# Altium project 2224_BuzzerWireGame.PrjPcb
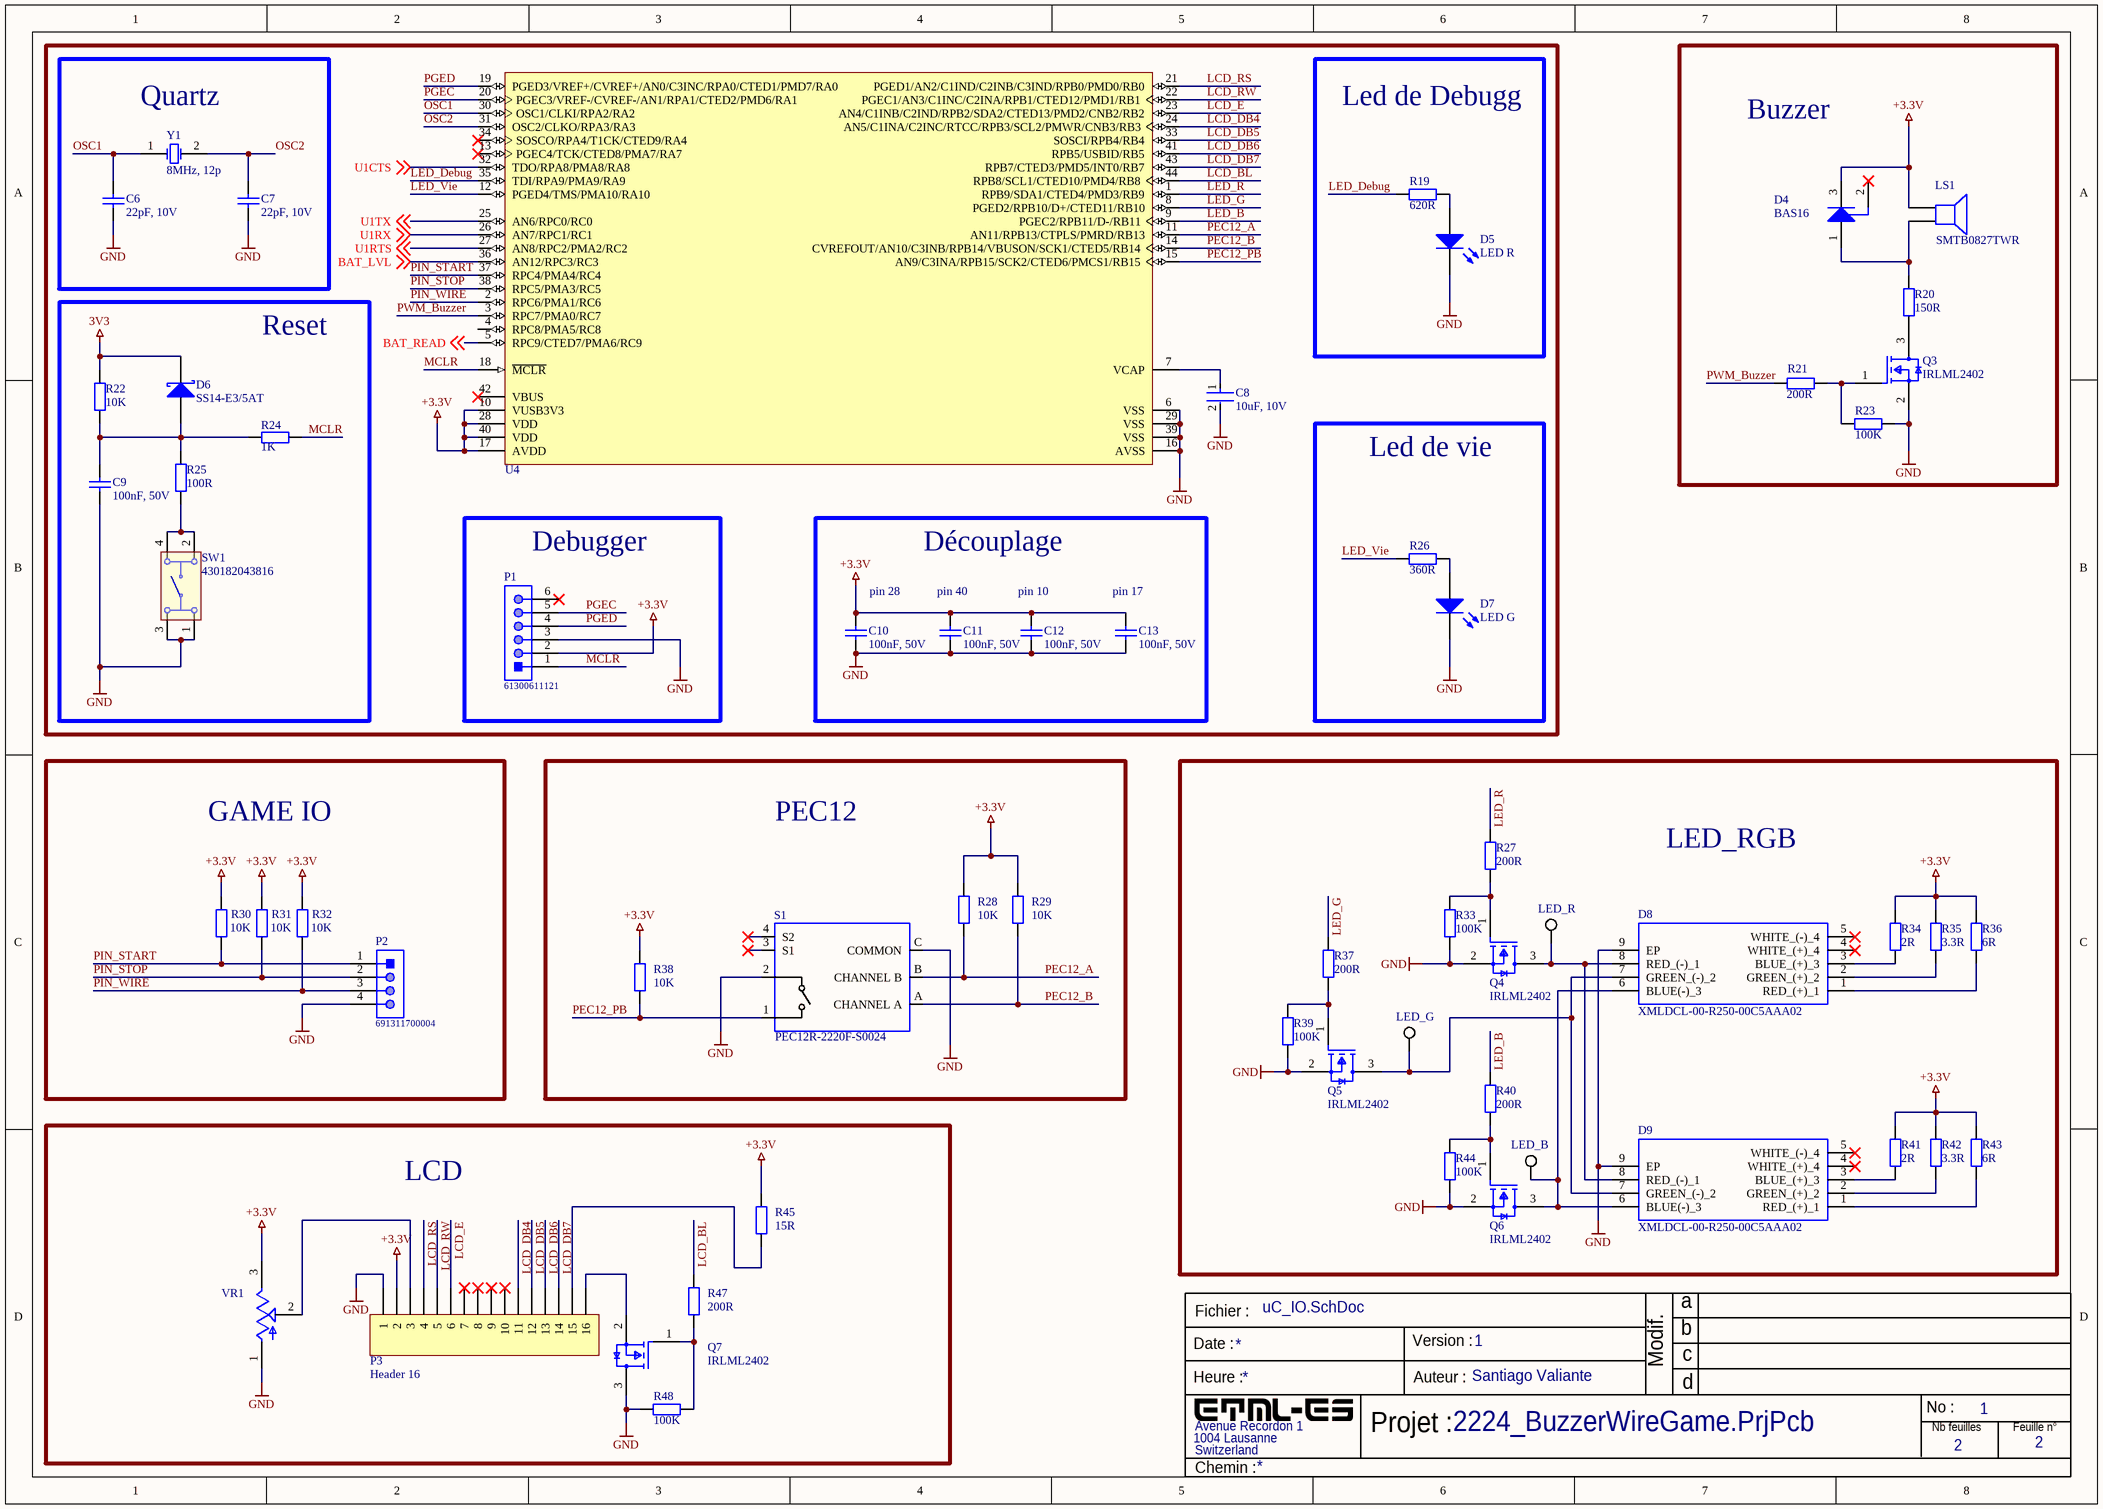
[diagram p0: uC_IO.SchDoc]
1 sheet, 60 parts. Net scope: global (net labels, ports and power ports of the same name join across sheets).
Board file: 2224_BuzzerWireGame.PcbDoc

## Sheet uC_IO.SchDoc
size A3; Author: Santiago Valiante; Organization: ETML-ES; Address1: Avenue Recordon 1; Address2: 1004 Lausanne; Address3: Switzerland; Revision: 1; SheetNumber: 2; SheetTotal: 2; SPICEModelCacheLIPLDXEE: <root> / <DocumentId>LIPLDXEE</DocumentId> / <CacheFrame Number="0"> / <Model Name="led2" Kind="MDL"> / <Text>*Typ RED,GREEN,YELLOW,AMBER GaAs LED: Vf=2.1V Vr=4V If=40mA trr=3uS / *LED Pinout: 1=A, 2=K / .MODEL LED2 D (IS=93.1P RS=42M N=4.61 BV=4 IBV=10U / + CJO=2.97P VJ=.75 M=.333 TT=4.32U)</Text> / </Model> / </CacheFrame> / </root>; Version: 1

### Parts
C6  22pF, 10V  [CAP_0805]
C7  22pF, 10V  [CAP_0805]
C8  10uF, 10V  [CAP_0805]
C9  100nF, 50V  [CAP_0805]
C10  100nF, 50V  [CAP_0805]
C11  100nF, 50V  [CAP_0805]
C12  100nF, 50V  [CAP_0805]
C13  100nF, 50V  [CAP_0805]
D4  BAS16  [INF-SOT23_L]
D5  LED R  [3.2X1.6X1.1]
D6  SS14-E3/5AT  [VISH-DO-214AC-2_V]
D7  LED G  [3.2X1.6X1.1]
D8  XMLDCL-00-R250-00C5AAA02  [XMLDCL00R25000C5AAA02]
D9  XMLDCL-00-R250-00C5AAA02  [XMLDCL00R25000C5AAA02]
LED_B  Vbat  [KSTN-5019_V]  (value not drawn)
LED_G  Vbat  [KSTN-5019_V]  (value not drawn)
LED_R  Vbat  [KSTN-5019_V]  (value not drawn)
LS1  SMTB0827TWR  [XDCR_SMTB-0827-TW-R]
P1  61300611121  [61300611121]
P2  691311700004  [691311700004]
P3  Header 16  [SHDR16W77P254_2X8_2764X859X1004P]
Q3  IRLML2402  [FP-Micro3-IPC_B]
Q4  IRLML2402  [FP-Micro3-IPC_B]
Q5  IRLML2402  [FP-Micro3-IPC_B]
Q6  IRLML2402  [FP-Micro3-IPC_B]
Q7  IRLML2402  [FP-Micro3-IPC_B]
R19  620R  [RES_0805]
R20  150R  [RES_0805]
R21  200R  [RES_0805]
R22  10K  [RES_0805]
R23  100K  [RES_0805]
R24  1K  [RES_0805]
R25  100R  [RES_0805]
R26  360R  [RES_0805]
R27  200R  [RES_0805]
R28  10K  [RES_0805]
R29  10K  [RES_0805]
R30  10K  [RES_0805]
R31  10K  [RES_0805]
R32  10K  [RES_0805]
R33  100K  [RES_0805]
R34  2R  [RES_0805]
R35  3.3R  [RES_0805]
R36  6R  [RES_0805]
R37  200R  [RES_0805]
R38  10K  [RES_0805]
R39  100K  [RES_0805]
R40  200R  [RES_0805]
R41  2R  [RES_0805]
R42  3.3R  [RES_0805]
R43  6R  [RES_0805]
R44  100K  [RES_0805]
R45  15R  [RES_0805]
R47  200R  [RES_0805]
R48  100K  [RES_0805]
S1  PEC12R-2220F-S0024  [XDCR_PEC12R-2220F-S0024]
SW1  430182043816  [430182043816]
U4  PIC32MX250F256D-I/PT  [MCHP-TQFP-PT44_M]  (value not drawn)
VR1  3362P-1-102LF  [TRIM_3362P-1-102LF]  (value not drawn)
Y1  8MHz, 12p  [FOX-FOXSDLF160-20_V]

### Blocks framed on the sheet
Quartz: C6 C7 Y1
Led de Debugg: D5 R19
Buzzer: D4 LS1 Q3 R20 R21 R23
Reset: C9 D6 R22 R24 R25 SW1
Led de vie: D7 R26
Debugger: P1
Découplage: C10-C13
GAME IO: P2 R30-R32
PEC12: R28 R29 R38 S1
LED_RGB: D8 D9 LED_B LED_G LED_R Q4-Q6 R27 R33-R37 R39-R44
LCD: P3 Q7 R45 R47 R48 VR1

### Nets
3V3: D6.2(K) R22.2
+3.3V: C10.1 C11.1 C12.1 C13.1 D4.3(K) LS1.P P1.2 P3.2 R28.2 R29.2 R30.2 R31.2 R32.2 R34.1 R35.1 R36.1 R38.2 R41.1 R42.1 R43.1 R45.2 U4.10(VUSB3V3) U4.17(AVDD) U4.28(VDD) U4.40(VDD) VR1.3(CW)
GND: C6.1 C7.1 C8.2 C9.2 C10.2 C11.2 C12.2 C13.2 D5.2(K) D7.2(K) D8.9(EP) D9.9(EP) P1.3 P2.4 P3.1 Q3.2(S) Q4.2(S) Q5.2(S) Q6.2(S) Q7.3(D) R23.2 R33.2 R39.2 R44.2 R48.2 S1.2 S1.C(COMMON) SW1.1 SW1.3 U4.6(VSS) U4.16(AVSS) U4.29(VSS) U4.39(VSS) VR1.1(CCW)
BAT_LVL: U4.36(AN12/RPC3/RC3) ; off-sheet BAT_LVL
BAT_READ: U4.5(RPC9/CTED7/PMA6/RC9) ; off-sheet BAT_READ
LCD_BL: R47.2 U4.44(RPB8/SCL1/CTED10/PMD4/RB8)
LCD_DB4: P3.11 U4.24(AN5/C1INA/C2INC/RTCC/RPB3/SCL2/PMWR/CNB3/RB3)
LCD_DB5: P3.12 U4.33(SOSCI/RPB4/RB4)
LCD_DB6: P3.13 U4.41(RPB5/USBID/RB5)
LCD_DB7: P3.14 U4.43(RPB7/CTED3/PMD5/INT0/RB7)
LCD_E: P3.6 U4.23(AN4/C1INB/C2IND/RPB2/SDA2/CTED13/PMD2/CNB2/RB2)
LCD_RS: P3.4 U4.21(PGED1/AN2/C1IND/C2INB/C3IND/RPB0/PMD0/RB0)
LCD_RW: P3.5 U4.22(PGEC1/AN3/C1INC/C2INA/RPB1/CTED12/PMD1/RB1)
LED_B: R40.2 U4.9(PGEC2/RPB11/D-/RB11)
LED_Debug: R19.2 U4.35(TDI/RPA9/PMA9/RA9)
LED_G: R37.2 U4.8(PGED2/RPB10/D+/CTED11/RB10)
LED_R: R27.2 U4.1(RPB9/SDA1/CTED4/PMD3/RB9)
LED_Vie: R26.2 U4.12(PGED4/TMS/PMA10/RA10)
MCLR: P1.1 R24.2 U4.18(~{MCLR})
OSC1: C6.2 U4.30(OSC1/CLKI/RPA2/RA2) Y1.1(X1)
OSC2: C7.2 U4.31(OSC2/CLKO/RPA3/RA3) Y1.2(X2)
PEC12_A: R28.1 S1.B(CHANNEL_B) U4.11(AN11/RPB13/CTPLS/PMRD/RB13)
PEC12_B: R29.1 S1.A(CHANNEL_A) U4.14(CVREFOUT/AN10/C3INB/RPB14/VBUSON/SCK1/CTED5/RB14)
PEC12_PB: R38.1 S1.1 U4.15(AN9/C3INA/RPB15/SCK2/CTED6/PMCS1/RB15)
PGEC: P1.5 U4.20(PGEC3/VREF-/CVREF-/AN1/RPA1/CTED2/PMD6/RA1)
PGED: P1.4 U4.19(PGED3/VREF+/CVREF+/AN0/C3INC/RPA0/CTED1/PMD7/RA0)
PIN_START: P2.1 R30.1 U4.37(RPC4/PMA4/RC4)
PIN_STOP: P2.2 R31.1 U4.38(RPC5/PMA3/RC5)
PIN_WIRE: P2.3 R32.1 U4.2(RPC6/PMA1/RC6)
PWM_Buzzer: R21.1 U4.3(RPC7/PMA0/RC7)
U1CTS: U4.32(TDO/RPA8/PMA8/RA8) ; off-sheet U1CTS
U1RTS: U4.27(AN8/RPC2/PMA2/RC2) ; off-sheet U1RTS
U1RX: U4.26(AN7/RPC1/RC1) ; off-sheet U1RX
U1TX: U4.25(AN6/RPC0/RC0) ; off-sheet U1TX
NetC8_1: C8.1 U4.7(VCAP)
NetC9_1: C9.1 D6.1(A) R22.1 R24.1 R25.2
NetD4_1: D4.1(A) LS1.N R20.1
NetD5_1: D5.1(A) R19.1
NetD7_1: D7.1(A) R26.1
NetD8_1: D8.1(RED_(+)_1) R36.2
NetD8_2: D8.2(GREEN_(+)_2) R35.2
NetD8_3: D8.3(BLUE_(+)_3) R34.2
NetD8_6: D8.6(BLUE(-)_3) D9.6(BLUE(-)_3) LED_B.1 Q6.3(D)
NetD8_7: D8.7(GREEN_(-)_2) D9.7(GREEN_(-)_2) LED_G.1 Q5.3(D)
NetD8_8: D8.8(RED_(-)_1) D9.8(RED_(-)_1) LED_R.1 Q4.3(D)
NetD9_1: D9.1(RED_(+)_1) R43.2
NetD9_2: D9.2(GREEN_(+)_2) R42.2
NetD9_3: D9.3(BLUE_(+)_3) R41.2
NetP3_3: P3.3 VR1.2(WIPER)
NetP3_15: P3.15 R45.1
NetP3_16: P3.16 Q7.2(S)
NetQ3_1: Q3.1(G) R21.2 R23.1
NetQ3_3: Q3.3(D) R20.2
NetQ4_1: Q4.1(G) R27.1 R33.1
NetQ5_1: Q5.1(G) R37.1 R39.1
NetQ6_1: Q6.1(G) R40.1 R44.1
NetQ7_1: Q7.1(G) R47.1 R48.1
NetR25_1: R25.1 SW1.2 SW1.4

Not connected (* = marked no-connect by the designer): D4 2(NC)*; D8 4(WHITE_(+)_4)* 5(WHITE_(-)_4)*; D9 4(WHITE_(+)_4)* 5(WHITE_(-)_4)*; P1 6*; P3 7* 8* 9* 10*; S1 3(S1)* 4(S2)*; U4 4(RPC8/PMA5/RC8) 13(PGEC4/TCK/CTED8/PMA7/RA7)* 34(SOSCO/RPA4/T1CK/CTED9/RA4)* 42(VBUS)*

### Notes on the sheet
- (near C10) pin 28
- (near C11) pin 40
- (near C12) pin 10
- (near C13) pin 17
- Fichier :
- a
- Date :
- Heure :
- Version :
- Auteur :
- Modif.
- b
- c
- d
- Projet :
- No :
- Nb feuilles
- Feuille n°
- Chemin :

### Library data of the parts
C6 C7 = CMP-1036-01211-1: CAP 22pF 10V ±10% 0805 (2012 Metric) Thickness 0.75mm SMD; Case-Metric: 2012; Tolerance: Â±10%; Case-EIA: 0805; Rated Voltage: 10 V; Technology: SMT; Max Thickness: 0.75 mm; Value: 22pF
C8 = CMP-2007-03243-2: CAP CER 10UF 10V X5R 0805; Manufacturer Part Number: C0805C106K8PACTU; Manufacturer: Kemet; 3DS Part Number: 220-00001; Tolerance: 10%; Temperature Coefficient: 15%; Material: Ceramic; Device Class L2: Capacitors; Device Class L1: Passive Components; ComponentLink2URL: https://content.kemet.com/datasheets/KEM_C1006_X5R_SMD.pdf; Height: 1.4mm; Lead Free: Yes; Digikey Description: CAP CER 10UF 10V X5R 0805; Octopart: https://octopart.com/c0805c106k8pactu-kemet-98697; Capacitance: 10uF; Value: 10uF; Temperature Range Low: -55°C; Temperature: -55°C to +85°C; Automotive: No; Mouser Description: CAP CER 10UF 10V X5R 0805; Ipc Land Pattern Name: CAPC200125X125; Temperature Range High: +85°C; Voltage: 10V; RoHS: TRUE; Device Class L3: Ceramic Capacitors; ComponentLink2Description: Datasheet; Voltage Rating: 10V; Package: C0805C-DG; Temperature Characteristic: X5R; Category: Cap
C9-C13 = 885012207098: WCAP-CSGP General Purpose Ceramic Capacitors, size 0805, 100nF, +/-10%, 50VDC; Isolation Resistance: >=5GOhm; Ceramic Type: X7R; Technical Reference: X7R0805104K050DFCT10000; ComponentLink1Description: Manufacturer; ComponentLink1URL: http://www.we-online.de; ComponentLink2Description: Datasheet; ComponentLink2URL: https://katalog.we-online.com/pbs/datasheet/885012207098.pdf; Operating Temperature: -55 to +125degC; Packaging: Tape and Reel; Part Number: 885012207098; Publisher: Wurth Elektronik; Rated Voltage: 50VDC; Published Date: August 2019; Capacitance Tolerance: +/-10%; Dissipation Factor: =<2.5%; Height: 0.8mm +/-0.10mm; Mounting Technology: SMD; Size: 0805; Capacitance: 100nF; Supplier 1: Digi-Key; Supplier Part Number 1: 732-8080-1-ND; Supplier 2: Distrelec; Supplier Part Number 2: 30067953
D4 = CMP-1176-00017-1: Silicon Switching Diode, SOT23, Reel, Green; Manufacturer: Infineon; VR (max): 80Â V; VBR (min): 85Â V; Configuration: Single; Green: TRUE; VF (max): 1.25Â V; trr (max): 4Â ns; IF (max): 250Â mA; IR (max): 100Â nA; ComponentLink3Description: Package Specification; PackageVersion: Apr-08; PackageReference: SOT23; ComponentLink2URL: http://www.infineon.com/dgdl/bas16series.pdf?folderId=db3a30431400ef6801141b5844e103ea&fileId=db3a30431400ef6801141b93811b03ff; Mounting Technology: Surface Mount; PartNumber: BAS16; ComponentLink2Description: Datasheet; ComponentLink1Description: Manufacturer URL; ComponentLink1URL: http://www.infineon.com/; ComponentLink3URL: http://www.infineon.com/dgdl/SOT23-Package_Overview.pdf?folderId=db3a30431936bc4b0119532290053c66&fileId=db3a30431936bc4b0119533468123c85; PackageDescription: 3-Pin Small Outline Transistor Package, 1.3 x 2.9 mm Body, 0.95 mm Pitch
D5 D7 = LED2: Typical RED, GREEN, YELLOW, AMBER GaAs LED; Published: 8-Jun-2000; LatestRevisionDate: 17-Jul-2002; LatestRevisionNote: Re-released for DXP Platform.; PackageVersion: Feb-2002; PackageReference: 3.2X1.6X1.1; Publisher: Altium Limited; PackageDescription: SM LED; 2 Flat Leads
D6 = CMP-0549-00004-1: Schottky Barrier Rectifier, 40 V Maximum DC Blocking Voltage, -65 to 125 degC, 2-Pin SMA Case, RoHS; Manufacturer: Vishay Semiconductor; IFSM: 40 A; IF(AV): 1 A Max.; VRRM: 40 V Max.; VRMS: 28 V Max.; PackageReference: DO-214AC-2; RoHS: TRUE; DatasheetVersion: 12/17/2012; ComponentLink1Description: Manufacturer URL; ComponentLink2URL: http://www.vishay.com/docs/88746/ss12.pdf; PartNumber: SS14-E3/5AT; PackageVersion: Dec-12; Operating Temperature: -65 to 125 degC; ComponentLink3URL: http://www.vishay.com/docs/88746/ss12.pdf; PackageDescription: 2-Pin SMD, Body 4.245 x 2.665 mm, Height 2.29 mm; ComponentLink1URL: http://www.vishay.com/; ComponentLink3Description: Package Specification; ComponentLink2Description: Datasheet; Mounting Technology: Surface Mount; VDC: 40 V Max.
D8 D9 = XMLDCL-00-R250-00C5AAA02: High Power LEDs - Multi-Colour RGB, White 6000K LED; Manufacturer_Name: Wolfspeed; Geometry.Height: 3.15mm; Manufacturer_Part_Number: XMLDCL-00-R250-00C5AAA02; Mouser Part Number: 941-XMLDCL0R25C5A02; Mouser Price/Stock: https://www.mouser.co.uk/ProductDetail/Cree-LED/XMLDCL-00-R250-00C5AAA02?qs=Znm5pLBrcALryTgji8xmYQ%3D%3D; Arrow Part Number: *; Arrow Price/Stock: *; Mouser Testing Part Number: *; Mouser Testing Price/Stock: *; Datasheet Link: https://eu.mouser.com/datasheet/2/723/XLamp_XMLDCL-2935899.pdf
LED_B LED_G LED_R = CMP-1672-00008-1: Test Point, 1 Position SMD, RoHS, Tape and Reel; ComponentLink1Description: Manufacturer URL; Package Quantity: 1000; DatasheetVersion: 03/2014; Packaging: Tape and Reel; ComponentLink2URL: http://www.keyelco.com/product-pdf.cfm?p=1357; ComponentLink1URL: http://www.keyelco.com/; Mount: Surface Mount; Contact Plating: Silver; PackageDescription: 1-Pin Surface Mount Device, Body 3.81 x 2.03 mm; Pins: 1; RoHSCompliant: True; Mounting Technology: Surface Mount; ComponentLink2Description: Datasheet; PackageReference: 5019
LS1 = Speaker: Loudspeaker; Published: 24-Mar-1999; LatestRevisionDate: 17-Jul-2002; LatestRevisionNote: Re-released for DXP Platform.; PackageReference: PIN2; Publisher: Altium Limited
P1 = CMP-1502-01070-1: THT Vertical Pin Header WR-PHD, Pitch 2.54 mm, Single Row, 6 pins; Manufacturer: Wurth Elektronik; Gender: Male; Pin Number: 6; Pitch: 2.54mm; Working Voltage: 250VAC; Rated Current: 3A; Withstanding Voltage: 500VAC; Contact Resistance: 20mOhm; Operating Temperature: -40to105degC; Packaging: Bag; Datasheet URL: https://katalog.we-online.de/em/datasheet/6130xx11121.pdf; Package Reference: 61300611121; Mounting Technology: THT; Publisher: WurthElektronik; Part Number: 61300611121; Manufacturer URL: http://www.we-online.de; Row Number: Single; Orientation: Vertical
P2 = CMP-1502-02028-1: Serie 3117 - 5.00mm Open Vertical PCB Header WR-TBL, 4 pin; Manufacturer: Wurth Elektronik; Gender: Male; Pin Number: 4; Packaging: Box; Pitch: 5.00mm; Manufacturer URL: http://www.we-online.de; Publisher: WurthElektronik; Package Reference: 691311700004; Datasheet URL: http://katalog.we-online.de/em/datasheet/6913117000xx.pdf; Mounting Technology: THT; Operating Temperature: -40to105degC; Part Number: 691311700004
P3 = Header 16: Header, 16-Pin; LatestRevisionDate: 17-Jul-2002; LatestRevisionNote: Re-released for DXP Platform.; Publisher: Altium Limited
Q3-Q7 = CMP-32901-000179-1: MOSFET N-CH 20V 1.2A SOT-23; Max Power Dissipation: 540mW; Gate to Source Voltage (Vgs): 12V; Drain to Source Resistance: 350mR; Rise Time: 9.5ns; Threshold Voltage: 700mV; Turn-On Delay Time: 2.5ns; Input Capacitance: 110pF; Element Configuration: Single; Power Dissipation: 540W; Turn-Off Delay Time: 9.7ns; Rds On Max: 250mR; REACH SVHC: No SVHC; Mount: Surface Mount; Packaging: Tape and Reel; Height: 0.04inch; Drain to Source Voltage (Vdss): 20V; Length: 0.119inch; Contact Plating: Tin; Continuous Drain Current (ID): 1.2A; Lead Free: Lead Free; Drain to Source Breakdown Voltage: 20V; Max Dual Supply Voltage: 20V; Number of Pins: 3; Halogen Free: Halogen Free; Max Operating Temperature: 150°C; Case/Package: SOT-23; Min Operating Temperature: -55°C; Width: 0.055inch
R19 R26 = CMP-2001-00528-1: Part Number: ERJ6ENF2703V; Manufacturer: Panasonic
R20 R21 R23 R27-R45 R47 R48 = Res2: Resistor; Published: 8-Jun-2000; LatestRevisionDate: 17-Jul-2002; LatestRevisionNote: Re-released for DXP Platform.; PackageReference: AXIAL-0.4; Publisher: Altium Limited; PackageDescription: Axial Device, Thru-Hole; 2 Leads; 0.4 in Pin Spacing
  R20: Value: 150R
  R21 R27 R37 R40 R47: Value: 200R
  R23 R33 R39 R44 R48: Value: 100K
  R28-R32 R38: Value: 10K
  R34 R41: Value: 2R
  R35 R42: Value: 3.3R
  R36 R43: Value: 6R
  R45: Value: 15R
R22 = CMP-2001-04376-1: Manufacturer: Panasonic; Part Number: ERJ-6ENF1002V
R24 = CMP-1013-00510-2: Part Number: CRCW08051K00FKEA; Manufacturer: Vishay Dale
R25 = CMP-2001-04723-1: Manufacturer: Vishay Dale; Part Number: TNPW0805100RBEEA
S1 = CMP-07421-000062-1: ROTARY ENCODER MECHANICAL 24PPR; Hole Diameter: 2.1mm; Built in Switch: Yes; Output Type: Quadrature; Pulses per Revolution: 24; Number of Channels: 2; Orientation: Right Angle; Length: 26mm; Width: 12.5mm; RoHS Compliant: Yes; Height: 13.4mm; Series: PEC12R; Mount: Through Hole; Package Quantity: 75; Max Operating Temperature: 70°C; Packaging: Bulk; Min Operating Temperature: -30°C; Encoder Type: Mechanical; Detent: Yes; Termination: PC Pin
SW1 = CMP-1452-00013-1: WS-TASV SMD Tact Switch 6X6 mm; Manufacturer: Wuerth Elektronik; NoPins: 04; ComponentLink2Description: Datasheet; PackageReference: 430182043816; ComponentLink2URL: http://katalog.we-online.de/em/datasheet/4301x2.pdf; ComponentLink1URL: http://www.we-online.com; PartNumber: 430182043816; ComponentLink1Description: Manufacturer URL
U4 = CMP-0048-00499-1: 32-bit Microcontroller with Audio and Graphics Interface, USB and Advanced Analog, 50 MHz, 33 I/O, PMP, -40 to 85 degC, 44-pin TQFP (PT44), Tray; PartNumber: PIC32MX250F128D-I/PT; Manufacturer: Microchip; PackageDescription: 44-Lead Plastic Thin Quad Flatpack, 10 x 10 mm Body, 0.8 mm Pitch; ComponentLink1Description: Manufacturer URL; ComponentLink4Description: Product URL; ComponentLink2Description: Datasheet; ComponentLink3Description: Package Specification; ComponentLink2URL: http://ww1.microchip.com/downloads/en/DeviceDoc/61168E.pdf; Mounting Technology: Surface Mount; PackageVersion: C04-076B; ComponentLink4URL: http://www.microchip.com/PIC32MX250F128D; PackageReference: TQFP-PT44; ComponentLink3URL: http://www.microchip.com/stellent/groups/techpub_sg/documents/packagingspec/en012702.pdf; ComponentLink1URL: http://www.microchip.com; DatasheetVersion: Rev. E
VR1 = 3362P-1-102LF: 1 kOhms 0.5W, 1/2W PC Pins Through Hole Trimmer Potentiometer Cermet 1 Turn Top Adjustment; MF: Bourns; Value: *; Purchase-URL: https://pricing.snapeda.com/search/part/3362P-1-102LF/?ref=eda; Price: None; MP: 3362P-1-102LF; Check_prices: https://www.snapeda.com/parts/3362P-1-102LF/Bourns/view-part/468358/?ref=eda; SnapEDA_Link: https://www.snapeda.com/parts/3362P-1-102LF/Bourns/view-part/468358/?ref=snap; Availability: Warning; Package: 3116 Bourns
Y1 = CMP-1749-00001-1: Resistance Weld SMD Crystal, 8 MHz, +/- 30 ppm, 12 pF, -20 to 70 degC, 2-Pin SMD, RoHS, Tape and Reel; Output Current: 3 mA; Case\Package: SOT-553-6; Min Supply Voltage (DC): 4 V; Max Supply Voltage: 3.3 V; Min Supply Voltage: 1.4 V; Interface: I2C; Max Supply Voltage (DC): 6 V; Value: 8M, 12p; ComponentLink2Description: Datasheet; REACH SVHC: No SVHC; ComponentLink1URL: http://www.foxonline.com/; ComponentLink2URL: http://foxonline.com/pdfs/hc49sdlf.pdf; Pins: 6; Packaging: Cut Tape; ComponentLink1Description: Manufacturer URL; Weight: 9.9E-05 oz; Length: 1.6 mm; RoHSCompliant: true; Min Operating Temperature: -55 degC; Radiation Hardening: No; PackageDescription: 2-Pin Surface Mount Device, Body 5 x 11.7 mm, Height 4.5 mm; Package Quantity: 1; Width: 1.2 mm; DatasheetVersion: Mar-15; Max Operating Temperature: 150 degC; Mount: Surface Mount; PackageReference: FOX-FOXSDLF160-20; Height: 0.55 mm